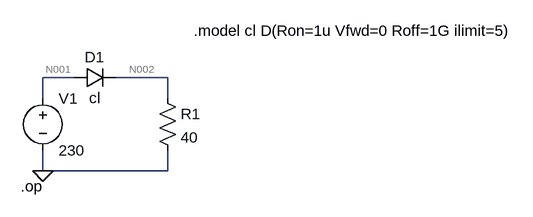
[diagram p0: schematic Draft4.asc]
Draft4.asc, the LTspice schematic file:
Version 4
SHEET 1 880 680
WIRE 80 112 32 112
WIRE 224 112 144 112
WIRE 32 144 32 112
WIRE 224 144 224 112
WIRE 32 256 32 224
WIRE 224 256 224 224
WIRE 224 256 32 256
FLAG 32 256 0
SYMBOL voltage 32 128 R0
WINDOW 123 0 0 Left 0
WINDOW 39 0 0 Left 0
SYMATTR InstName V1
SYMATTR Value 230
SYMBOL res 208 128 R0
SYMATTR InstName R1
SYMATTR Value 40
SYMBOL diode 80 128 R270
WINDOW 0 32 32 VTop 2
WINDOW 3 0 32 VBottom 2
SYMATTR InstName D1
SYMATTR Value cl
TEXT -2 280 Left 2 !.op
TEXT 264 40 Left 2 !.model cl D(Ron=1u Vfwd=0 Roff=1G ilimit=5)

The netlist it stands for:
* Draft4.asc
V1 N001 0 230
R1 N002 0 40
D1 N001 N002 cl
.model D D
.lib standard.dio
.op
.model cl D(Ron=1u Vfwd=0 Roff=1G ilimit=5)
.backanno
.end

* Results of the author's LTspice run, read from the files saved beside the schematic
* Operating Point:
*   V(n001) = 230 V
*   V(n002) = 230 V
*   I(D1) = 4.867 A
*   I(R1) = 5.75 A
*   I(V1) = -5.75 A